# Altium schematic sheet Copy of Bramka_Main.SchDoc
size A4; SheetNumber: 1; SheetTotal: 8
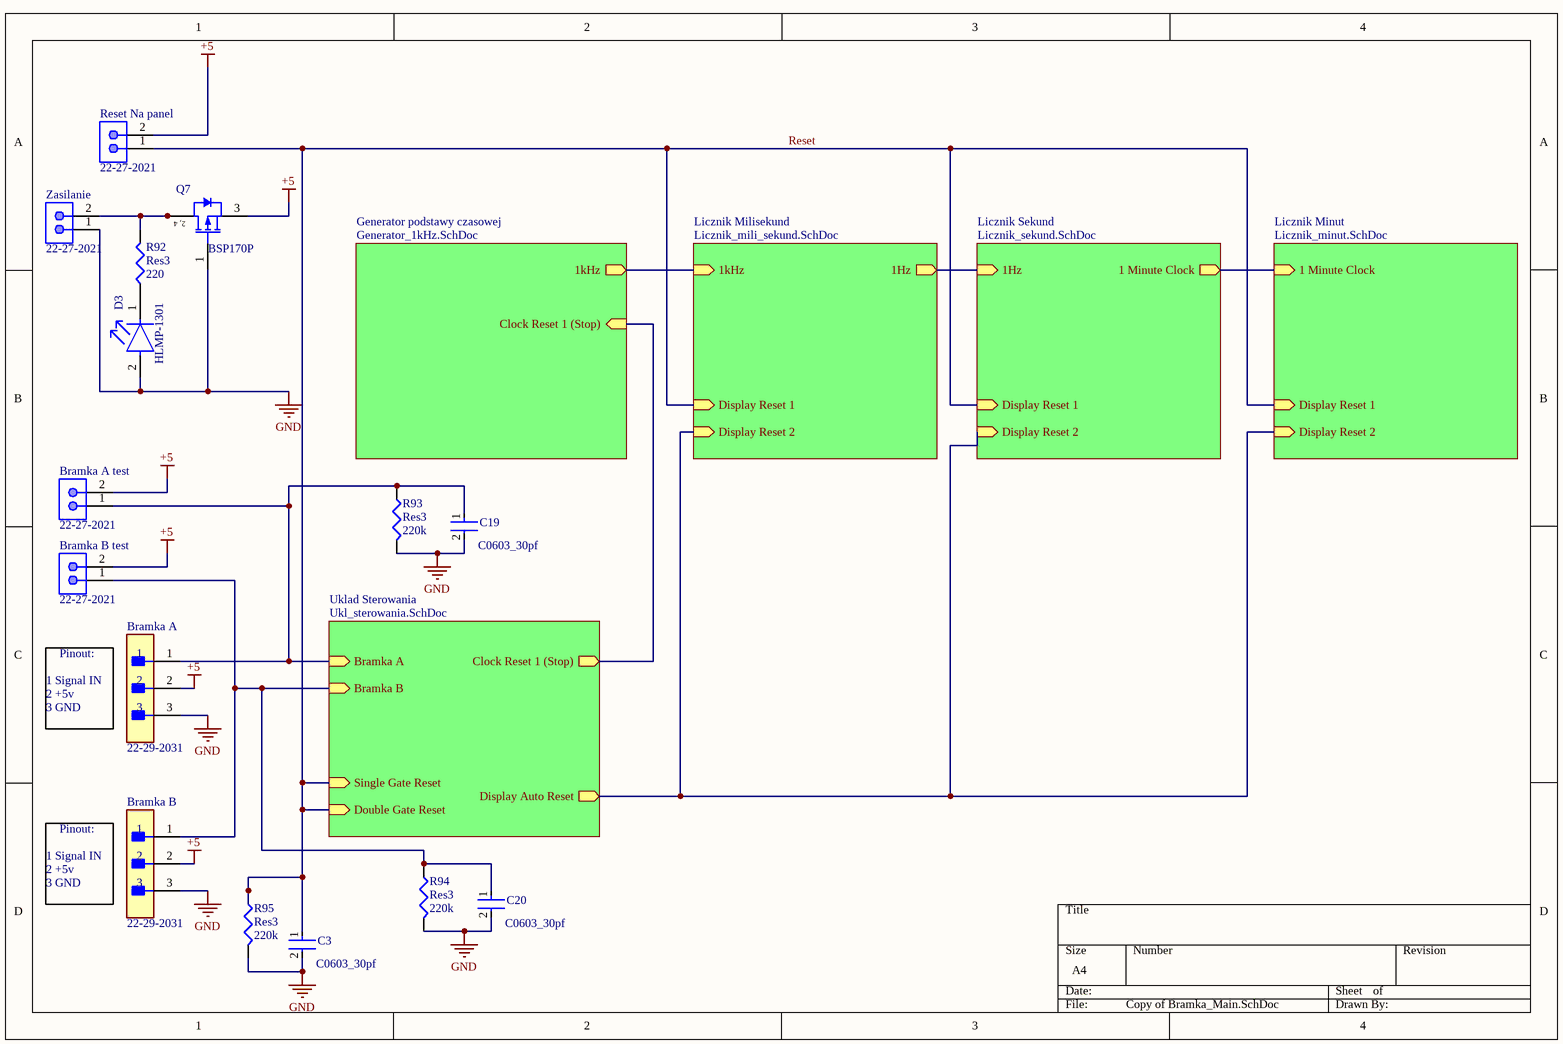
[diagram p0: Copy of Bramka_Main.SchDoc]

## Parts
Bramka_A  22-29-2031  [FP-22-29-2031-MFG]
Bramka_A_test  22-27-2021  [MOLX-22-27-2021_V]
Bramka_B  22-29-2031  [FP-22-29-2031-MFG]
Bramka_B_test  22-27-2021  [MOLX-22-27-2021_V]
C3  C0603_30pf  [FP-C0603C-CF-MFG]
C19  C0603_30pf  [FP-C0603C-CF-MFG]
C20  C0603_30pf  [FP-C0603C-CF-MFG]
D3  HLMP-1301  [FP-HLMP-1301-MFG]
Q7  BSP170P  [INF-PG-SOT223_SC-73_N]
R92  Res3  value 220  [6-0805_M]
R93  Res3  value 220k  [J1-0603]
R94  Res3  value 220k  [J1-0603]
R95  Res3  value 220k  [J1-0603]
Reset_Na_panel  22-27-2021  [MOLX-22-27-2021_V]
Zasilanie  22-27-2021  [MOLX-22-27-2021_V]

## Sub-sheets
Generator podstawy czasowej = Generator_1kHz.SchDoc: Clock Reset 1 (Stop) (in), 1kHz (out)
Licznik Milisekund = Licznik_mili_sekund.SchDoc: 1kHz (in), 1Hz (out), Display Reset 1 (in), Display Reset 2 (in)
Licznik Minut = Licznik_minut.SchDoc: 1 Minute Clock (in), Display Reset 1 (in), Display Reset 2 (in)
Licznik Sekund = Licznik_sekund.SchDoc: 1 Minute Clock (out), 1Hz (in), Display Reset 1 (in), Display Reset 2 (in)
Uklad Sterowania = Ukl_sterowania.SchDoc: Bramka A (in), Bramka B (in), Clock Reset 1 (Stop) (out), Single Gate Reset (in), Double Gate Reset (in), Display Auto Reset (out)

## Nets
+5: Bramka_A.2 Bramka_A_test.2 Bramka_B.2 Bramka_B_test.2 Q7.3(SOURCE) Reset_Na_panel.2
GND: Bramka_A.3 Bramka_B.3 C3.2 C19.2 C20.2 D3.2(A) Q7.1(GATE) R93.2 R94.2 R95.2 Zasilanie.1
Reset: C3.1 R95.1 Reset_Na_panel.1 ; sheet Licznik Milisekund/Display Reset 1, sheet Licznik Sekund/Display Reset 1, sheet Licznik Minut/Display Reset 1, sheet Uklad Sterowania/Single Gate Reset, sheet Uklad Sterowania/Double Gate Reset
NetBramka_A_1: Bramka_A.1 Bramka_A_test.1 C19.1 R93.1 ; sheet Uklad Sterowania/Bramka A
NetBramka_B_1: Bramka_B.1 Bramka_B_test.1 C20.1 R94.1 ; sheet Uklad Sterowania/Bramka B
NetD3_1: D3.1(C) R92.1
NetQ7_2: Q7.2(DRAIN) Q7.4(DRAIN) R92.2 Zasilanie.2
(unnamed): sheet Generator podstawy czasowej/Clock Reset 1 (Stop), sheet Uklad Sterowania/Clock Reset 1 (Stop)
(unnamed): sheet Generator podstawy czasowej/1kHz, sheet Licznik Milisekund/1kHz
(unnamed): sheet Licznik Milisekund/1Hz, sheet Licznik Sekund/1Hz
(unnamed): sheet Licznik Milisekund/Display Reset 2, sheet Licznik Sekund/Display Reset 2, sheet Licznik Minut/Display Reset 2, sheet Uklad Sterowania/Display Auto Reset
(unnamed): sheet Licznik Sekund/1 Minute Clock, sheet Licznik Minut/1 Minute Clock

## Notes on the sheet
- Pinout:
- (near Bramka_A) 1 Signal IN
- 2 +5v
- 3 GND
- (near Bramka_B) 1 Signal IN
- (near Bramka_B) Pinout:
- (in symbol CMP-1099-00020-1) 2, 4

## Library data of the parts
Bramka_A Bramka_B = CMP-04776-000327-1: CONN HEADER VERT 3POS 2.54MM; Contact Resistance: 10mR; Number of Positions: 3; Voltage Rating: 250V; Gender: Male; Connector Type: Male Pin; Current Rating: 4A; Packaging: Bulk; Housing Material: Nylon; Min Operating Temperature: 0°C; Color: Natural; RoHS Compliant: Yes; Housing Color: White; Number of Rows: 1; Pitch: 2.54mm; Mount: Through Hole; Fastening Type: Friction; Length: 7.62mm; Depth: 5.8mm; Contact Material: Brass; Max Operating Temperature: 75°C; Number of Contacts: 3; Contact Type: Male Pin; Working Voltage: 250V; Orientation: Straight; Lead Pitch: 2.54mm; Radiation Hardening: No; Termination: Solder; Contact Plating: Gold; Contact Mating Length: 0.295inch; Series: KK® 6410
Bramka_A_test Bramka_B_test Reset_Na_panel Zasilanie = CMP-2000-05537-1: Male Header, Pitch 2.54 mm, 1 x 2 Position, Height 11.7 mm, Tail Length 3.56 mm, 0 to 75 degC, RoHS, Bulk; Manufacturer: Molex; PartNumber: 0022272021; Current rating: 4A; Package Version: Rev. BC, 02/2012; Voltage rating: 250V; No. of Positions: 2; Pitch: 2.54mm; No. of Rows: 1; Orientation: Vertical; Operating temperature: 0°Cto+75°C; Manufacturer URL: http://www.molex.com/; Mounting Technology: ThroughHole; Housing material: Nylon(UL94V-0); Package Description: 2-Leads Header, Body 5.08 x 5.8 mm, Pitch 2.54 mm; Voltage - Max: 250V; Datasheet URL: http://www.molex.com/pdm_docs/sd/022272021_sd.pdf; Package Reference: 22-27-2021; Contact material: Tinplatedbrass; Current - Max: 4A; Datasheet Version: Rev. F, 06/2009
C3 C19 C20 = CMP-1035-00914-3: CAP CER 30PF 50V 5% NP0 0603; Manufacturer Part Number: C0603C300J5GACTU; Manufacturer: KEMET; Automotive Grade: Grade 1; Temperature Coefficient: 30ppm/°C; Material: Ceramic; Temperature Characteristic: C0G; Tolerance: 0.05; ComponentLink2URL: https://api.kemet.com/component-edge/download/datasheet/C0603C100J5GACAUTO.pdf; Automotive: Yes; Device Class L2: Capacitors; Device Class L1: Passive Components; Device Class L3: Ceramic Capacitors; RoHS: TRUE; Octopart: https://octopart.com/c0603c300j5gactu-kemet-199455; Lead Free: Yes; Value: 30 pF; Temperature Range High: +125°C; Category: Cap; Temperature: -55°C to +125°C; Package: C0603C-CF; Capacitance: 30 pF; Digikey Description: CAP CER 30PF 50V 5% NP0 0603; Height: 0.87mm; ComponentLink2Description: Datasheet; Temperature Range Low: -55°C; Mouser Description: Multilayer Ceramic Capacitors MLCC - SMD/SMT 50volts 30pF C0G 5%; Voltage Rating: 50 V
D3 = CMP-18399-000007-1: LED RED DIFFUSED T-1 T/H; Manufacturer: Broadcom; Forward Current: 10mA; Max Junction Temp: +110°C; Wavelength: 626nm; Led Orientation: Straight; Viewing Angle: 60°; Luminous Intensity: 3.4mcd; Forward Voltage: 1.9V; Reverse Voltage: 5V; Peak Emmision Wavelength: 635nm; Mouser Description: Standard LEDs - Through Hole Red Diffused 635nm 3.4mcd; RoHS: TRUE; ComponentLink2Description: Datasheet; Device Class L1: Optoelectronics; Temperature Range High: +100°C; Manufacturer Part Number: HLMP-1301; ComponentLink2URL: https://docs.broadcom.com/docs/AV02-1555EN; Colour: Red; Digikey Description: LED RED DIFFUSED T-1 T/H; Automotive: No; Device Class L2: LEDs; Temperature Range Low: -40°C; Octopart: https://octopart.com/hlmp-1301-broadcom-71130345; Category: Diode; Lead Free: Yes; Device Class L3: unset; Package: 0; Temperature: -40°C to +100°C
Q7 = CMP-1099-00020-1: P-Channel SIPMOS Small-Signal-Transistor, -60 V VDS, -1.9 A ID, -55 to 150 degC, PG-SOT223 (SC-73), Reel, Green; Manufacturer: Infineon; Pto t (max): 1.8Â mW; Polarity: P; VDS (max): -60Â V; RDS (on) (max): 300Â mOhm; IDpuls (max): -7.6Â A; Green: TRUE; Rth: 110Â K/W; VGS(th) (max): -4Â V; VGS(th) (min): -2.1Â V; ID (max): -1.9Â A; Mode: Enhancement; QG: -12.5Â nC; PackageVersion: Apr-08; PartNumber: BSP170P; ComponentLink1Description: Manufacturer URL; ComponentLink2Description: Datasheet; PackageReference: PG-SOT223 (SC-73); Mounting Technology: Surface Mount; ComponentLink2URL: http://www.infineon.com/dgdl/BSP170P_Rev2.53.pdf?folderId=db3a304314dca38901154a72e3951a65&fileId=db3a30433b47825b013b5fdad470576f; ComponentLink1URL: http://www.infineon.com/; ComponentLink3Description: Package Specification; Halogen-free: TRUE; Packing: Reel; Technology: SIPMOS; DatasheetVersion: Rev. 2.53; ComponentLink3URL: http://www.infineon.com/dgdl/SOT223-Package_Overview.pdf?folderId=db3a30431936bc4b0119530470b03c3d&fileId=db3a30431936bc4b0119531d40b93c5c; PackageDescription: 4-Pin Small Outline Transistor Package, 6.5 x 3.5 mm Body, 2.3 mm Pitch
R92-R95 = Res3: Resistor; Published: 8-Jun-2000; LatestRevisionDate: 29-May-2009; LatestRevisionNote: IPC-7351 Footprint Added.; PackageReference: J1-0603; Publisher: Altium Limited; PackageDescription: Chip Resistor